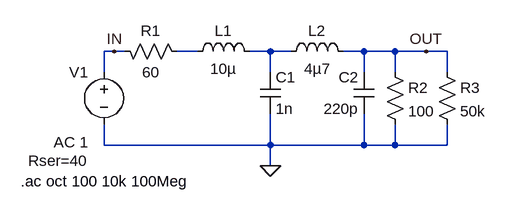
[diagram p0: schematic BB-Filter.asc]
BB-Filter.asc, the LTspice schematic file:
Version 4
SHEET 1 880 680
WIRE 0 128 -16 128
WIRE 16 128 0 128
WIRE 128 128 96 128
WIRE 240 128 208 128
WIRE 272 128 240 128
WIRE 384 128 352 128
WIRE 432 128 384 128
WIRE 480 128 432 128
WIRE 512 128 480 128
WIRE -16 160 -16 128
WIRE 240 160 240 128
WIRE 384 160 384 128
WIRE 432 160 432 128
WIRE 512 160 512 128
WIRE -16 272 -16 240
WIRE 240 272 240 224
WIRE 240 272 -16 272
WIRE 384 272 384 224
WIRE 384 272 240 272
WIRE 432 272 432 240
WIRE 432 272 384 272
WIRE 512 272 512 240
WIRE 512 272 432 272
WIRE 240 304 240 272
FLAG 240 304 0
FLAG 480 128 OUT
FLAG 0 128 IN
SYMBOL res 112 144 M270
WINDOW 0 32 56 VTop 2
WINDOW 3 0 56 VBottom 2
SYMATTR InstName R1
SYMATTR Value 60
SYMBOL res 416 144 R0
SYMATTR InstName R2
SYMATTR Value 100
SYMBOL voltage -16 144 M0
WINDOW 123 24 124 Left 2
WINDOW 39 24 152 Left 2
SYMATTR Value2 AC 1
SYMATTR SpiceLine Rser=40
SYMATTR InstName V1
SYMATTR Value ""
SYMBOL res 496 144 R0
SYMATTR InstName R3
SYMATTR Value 50k
SYMBOL ind 112 144 R270
WINDOW 0 32 56 VTop 2
WINDOW 3 5 56 VBottom 2
SYMATTR InstName L1
SYMATTR Value 10µ
SYMBOL cap 224 160 R0
SYMATTR InstName C1
SYMATTR Value 1n
SYMBOL ind 256 144 R270
WINDOW 0 32 56 VTop 2
WINDOW 3 5 56 VBottom 2
SYMATTR InstName L2
SYMATTR Value 4µ7
SYMBOL cap 400 160 M0
SYMATTR InstName C2
SYMATTR Value 220p
TEXT -144 328 Left 2 !.ac oct 100 10k 100Meg

The netlist it stands for:
* BB-Filter.asc
R1 N001 IN 60
R2 OUT 0 100
V1 IN 0 AC 1 Rser=40
R3 OUT 0 50k
L1 N001 N002 10µ
C1 N002 0 1n
L2 N002 OUT 4µ7
C2 OUT 0 220p
.ac oct 100 10k 100Meg
.backanno
.end